# Altium project ENGG4000-SysMoDEL-BMS (1).PrjPcb (part 2 of 2)

## Sheet BMS_MCU.SchDoc
size Tabloid; SheetNumber: 3; SheetTotal: 3
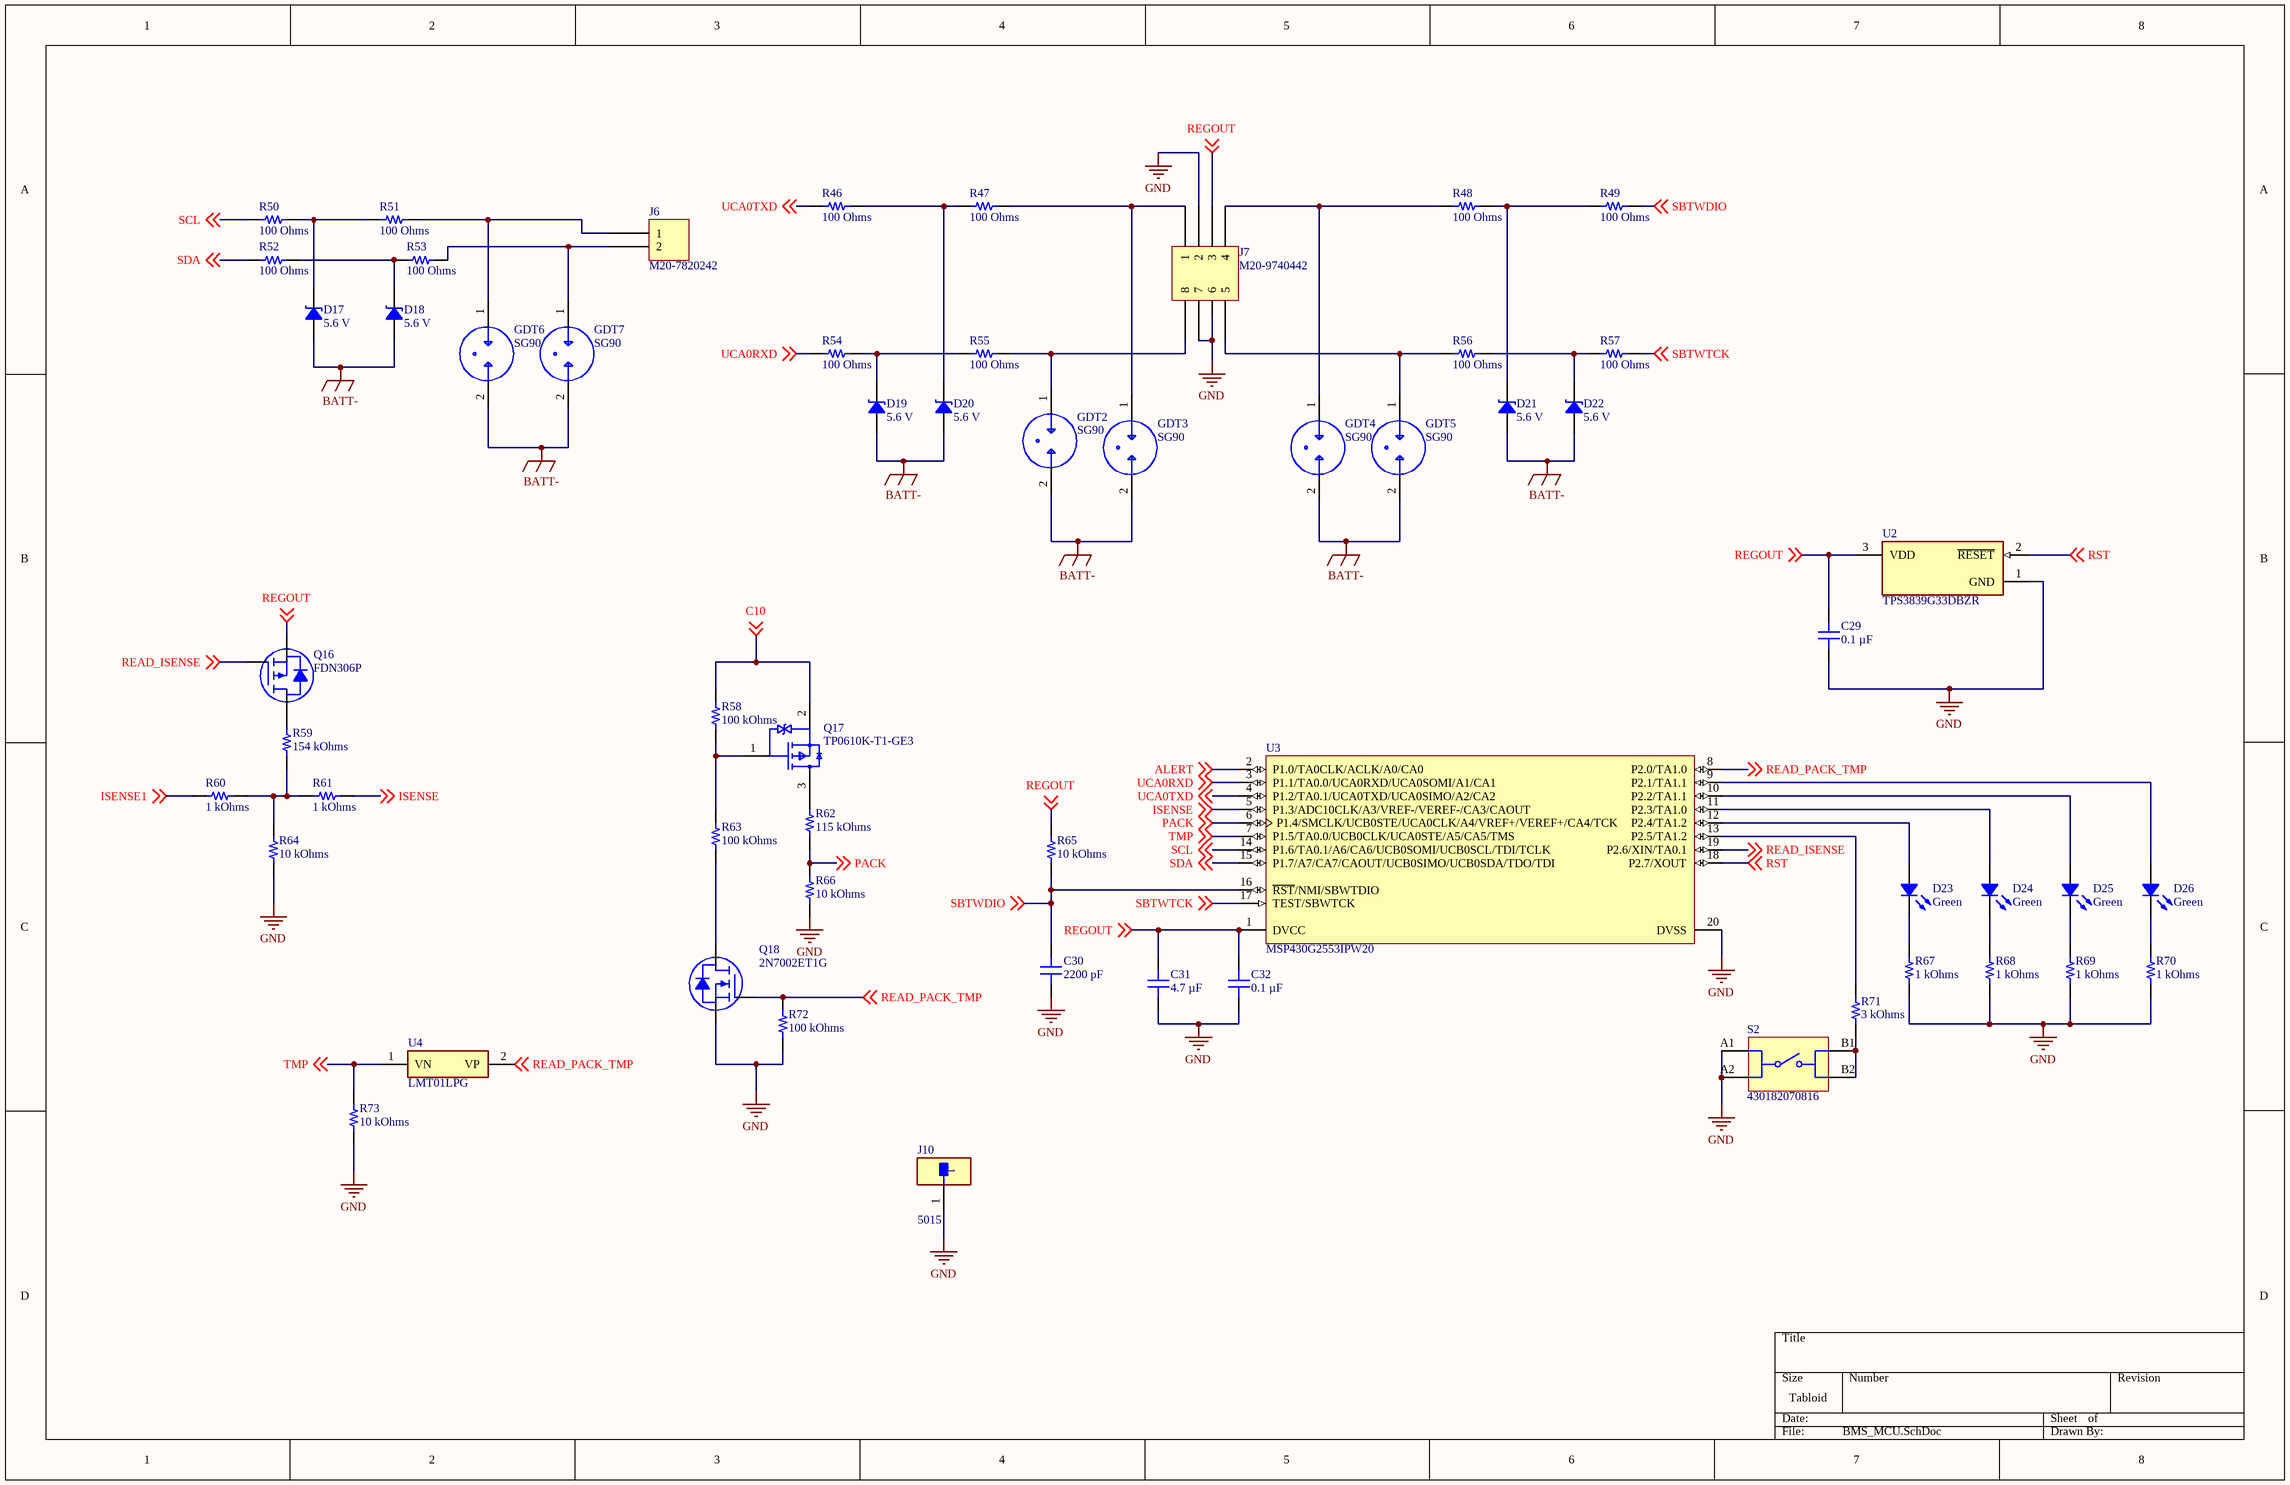
[diagram p2: BMS_MCU.SchDoc]

### Parts
C29  0.1 µF  [CAP 0603_1608]
C30  2200 pF  [CAP 0603_1608]
C31  4.7 µF  [CAP 0805_2012]
C32  0.1 µF  [CAP 0603_1608]
D17  Voltage - Zener (Nom) (Vz): 5.6 V  [SOD323]  (hidden comment: MMSZ5232BS-7-F)
D18  Voltage - Zener (Nom) (Vz): 5.6 V  [SOD323]  (hidden comment: MMSZ5232BS-7-F)
D19  Voltage - Zener (Nom) (Vz): 5.6 V  [SOD323]  (hidden comment: MMSZ5232BS-7-F)
D20  Voltage - Zener (Nom) (Vz): 5.6 V  [SOD323]  (hidden comment: MMSZ5232BS-7-F)
D21  Voltage - Zener (Nom) (Vz): 5.6 V  [SOD323]  (hidden comment: MMSZ5232BS-7-F)
D22  Voltage - Zener (Nom) (Vz): 5.6 V  [SOD323]  (hidden comment: MMSZ5232BS-7-F)
D23  Green  [LED 0603_1608 GREEN]
D24  Green  [LED 0603_1608 GREEN]
D25  Green  [LED 0603_1608 GREEN]
D26  Green  [LED 0603_1608 GREEN]
GDT2  SG90  [FP-SG-MFG]
GDT3  SG90  [FP-SG-MFG]
GDT4  SG90  [FP-SG-MFG]
GDT5  SG90  [FP-SG-MFG]
GDT6  SG90  [FP-SG-MFG]
GDT7  SG90  [FP-SG-MFG]
J6  M20-7820242  [HARWIN M20-7820245]
J7  M20-9740442  [HARWIN M20-9740445]
J10  5015  [FP-5015-MFG]
Q16  FDN306P  [ON SEMI SOT-23-3]
Q17  TP0610K-T1-GE3  [FP-S-03946-IPC_C]
Q18  2N7002ET1G  [ON SEMI SOT-23-3]
R46  100 Ohms  [RES 0805_2012]
R47  100 Ohms  [RES 0805_2012]
R48  100 Ohms  [RES 0805_2012]
R49  100 Ohms  [RES 0805_2012]
R50  100 Ohms  [RES 0805_2012]
R51  100 Ohms  [RES 0805_2012]
R52  100 Ohms  [RES 0805_2012]
R53  100 Ohms  [RES 0805_2012]
R54  100 Ohms  [RES 0805_2012]
R55  100 Ohms  [RES 0805_2012]
R56  100 Ohms  [RES 0805_2012]
R57  100 Ohms  [RES 0805_2012]
R58  100 kOhms  [RES 0603_1608]
R59  154 kOhms  [RES 0603_1608]
R60  1 kOhms  [RES 0603_1608]
R61  1 kOhms  [RES 0603_1608]
R62  115 kOhms  [RES 0603_1608]
R63  100 kOhms  [RES 0603_1608]
R64  10 kOhms  [RES 0603_1608]
R65  10 kOhms  [RES 0603_1608]
R66  10 kOhms  [RES 0603_1608]
R67  1 kOhms  [RES 0603_1608]
R68  1 kOhms  [RES 0603_1608]
R69  1 kOhms  [RES 0603_1608]
R70  1 kOhms  [RES 0603_1608]
R71  3 kOhms  [RES 0603_1608]
R72  100 kOhms  [RES 0603_1608]
R73  10 kOhms  [RES 0603_1608]
S2  430182070816  [430182070816]
U2  TPS3839G33DBZR  [FP-DBZ0003A-MFG]
U3  MSP430G2553IPW20  [PW0020A_L]
U4  LMT01LPG  [FP-LPG0002A-MFG]

### Nets
BATT-: D17.1 D18.1 D19.1 D20.1 D21.1 D22.1 GDT2.2 GDT3.2 GDT4.2 GDT5.2 GDT6.2 GDT7.2
GND: C29.1 C30.1 C31.1 C32.1 J7.2 J7.6 J7.7 J10.1 Q18.2(S) R64.1 R66.1 R67.1 R68.1 R69.1 R70.1 R72.1 R73.1 S2.A1 S2.A2 U2.1(GND) U3.20(DVSS)
ALERT: U3.2(P1.0/TA0CLK/ACLK/A0/CA0) ; off-sheet ALERT
C10: Q17.2(S) R58.2 ; off-sheet C10
ISENSE: R61.2 U3.5(P1.3/ADC10CLK/A3/VREF-/VEREF-/CA3/CAOUT) ; off-sheet ISENSE
ISENSE1: R60.1 ; off-sheet ISENSE1
PACK: R62.1 R66.2 U3.6(P1.4/SMCLK/UCB0STE/UCA0CLK/A4/VREF+/VEREF+/CA4/TCK) ; off-sheet PACK
READ_ISENSE: Q16.1(G) U3.19(P2.6/XIN/TA0.1) ; off-sheet READ_ISENSE
READ_PACK_TMP: Q18.1(G) R72.2 U3.8(P2.0/TA1.0) U4.2(VP) ; off-sheet READ_PACK_TMP
REGOUT: C29.2 C31.2 C32.2 J7.3 Q16.2(S) R65.2 U2.3(VDD) U3.1(DVCC) ; off-sheet REGOUT
RST: U2.2(~{RESET}) U3.18(P2.7/XOUT) ; off-sheet RST
SBTWDIO: C30.2 R49.1 R65.1 U3.16(~{RST}/NMI/SBWTDIO) ; off-sheet SBTWDIO
SBTWTCK: R57.1 U3.17(TEST/SBWTCK) ; off-sheet SBTWTCK
SCL: R50.2 U3.14(P1.6/TA0.1/A6/CA6/UCB0SOMI/UCB0SCL/TDI/TCLK) ; off-sheet SCL
SDA: R52.2 U3.15(P1.7/A7/CA7/CAOUT/UCB0SIMO/UCB0SDA/TDO/TDI) ; off-sheet SDA
TMP: R73.2 U3.7(P1.5/TA0.0/UCB0CLK/UCA0STE/A5/CA5/TMS) U4.1(VN) ; off-sheet TMP
UCA0RXD: R54.2 U3.3(P1.1/TA0.0/UCA0RXD/UCA0SOMI/A1/CA1) ; off-sheet UCA0RXD
UCA0TXD: R46.2 U3.4(P1.2/TA0.1/UCA0TXD/UCA0SIMO/A2/CA2) ; off-sheet UCA0TXD
NetD17_2: D17.2 R50.1 R51.2
NetD18_2: D18.2 R52.1 R53.2
NetD19_2: D19.2 R54.1 R55.2
NetD20_2: D20.2 R46.1 R47.2
NetD21_2: D21.2 R48.1 R49.2
NetD22_2: D22.2 R56.1 R57.2
NetD23_1: D23.1 U3.12(P2.4/TA1.2)
NetD23_2: D23.2 R67.2
NetD24_1: D24.1 U3.11(P2.3/TA1.0)
NetD24_2: D24.2 R68.2
NetD25_1: D25.1 U3.10(P2.2/TA1.1)
NetD25_2: D25.2 R69.2
NetD26_1: D26.1 U3.9(P2.1/TA1.1)
NetD26_2: D26.2 R70.2
NetGDT2_1: GDT2.1 J7.8 R55.1
NetGDT3_1: GDT3.1 J7.1 R47.1
NetGDT4_1: GDT4.1 J7.4 R48.2
NetGDT5_1: GDT5.1 J7.5 R56.2
NetGDT6_1: GDT6.1 J6.1 R51.1
NetGDT7_1: GDT7.1 J6.2 R53.1
NetQ16_3: Q16.3(D) R59.2
NetQ17_1: Q17.1(G) R58.1 R63.2
NetQ17_3: Q17.3(D) R62.2
NetQ18_3: Q18.3(D) R63.1
NetR59_1: R59.1 R60.2 R61.1 R64.2
NetR71_1: R71.1 S2.B1 S2.B2
NetR71_2: R71.2 U3.13(P2.5/TA1.2)

### Library data of the parts
C29 C32 = 885012206046: CAP CER 0.1UF 16V X7R 0603; manufacturer: Würth Elektronik; Tolerance: ±10%; Part Number: 885012206046; Capacitance: 0.1 µF; Applications: General Purpose; componentlink1description: Datasheet; componentlink1url: https://katalog.we-online.de/pbs/datasheet/885012206046.pdf; componentlink2description: DigiKey Link; componentlink2url: https://www.digikey.com/en/products/detail/würth-elektronik/885012206046/5453820; Device Package: 0603 (1608 Metric); lastupdated: 2/9/2024 8:10:12 PM; Lifecycle Status: Active; Minimum Order: 1; Mounting Type: Surface Mount, MLCC; Operating Temperature: -55°C ~ 125°C; Package / Case: 0603 (1608 Metric); packaging: TapeAndReel; partid: 15291; Part Status: Active; price: 0.03; series: WCAP-CSGP; Size / Dimension: 0.063" L x 0.031" W (1.60mm x 0.80mm); Supplier 1: DigiKey; Supplier Part Number 1: 732-7965-1-ND; Temperature Coefficient: X7R; Thickness (Max): 0.034" (0.87mm); value: 0.1 µF; Voltage - Rated: 16V
C30 = 885012206036: CAP CER 2200PF 16V X7R 0603; manufacturer: Würth Elektronik; Tolerance: ±10%; Part Number: 885012206036; Capacitance: 2200 pF; Applications: General Purpose; componentlink1description: Datasheet; componentlink1url: https://katalog.we-online.de/pbs/datasheet/885012206036.pdf; componentlink2description: DigiKey Link; componentlink2url: https://www.digikey.com/en/products/detail/würth-elektronik/885012206036/5453810; Device Package: 0603 (1608 Metric); lastupdated: 2/9/2024 8:10:11 PM; Lifecycle Status: Active; Minimum Order: 1; Mounting Type: Surface Mount, MLCC; Operating Temperature: -55°C ~ 125°C; Package / Case: 0603 (1608 Metric); packaging: TapeAndReel; partid: 15804; Part Status: Active; price: 0.02; series: WCAP-CSGP; Size / Dimension: 0.063" L x 0.031" W (1.60mm x 0.80mm); Supplier 1: DigiKey; Supplier Part Number 1: 732-7955-1-ND; Temperature Coefficient: X7R; Thickness (Max): 0.034" (0.87mm); value: 2200 pF; Voltage - Rated: 16V
C31 = 885012207025: CAP CER 4.7UF 10V X7R 0805; manufacturer: Würth Elektronik; Tolerance: ±10%; Part Number: 885012207025; Capacitance: 4.7 µF; Applications: General Purpose; componentlink1description: Datasheet; componentlink1url: https://katalog.we-online.de/pbs/datasheet/885012207025.pdf; componentlink2description: DigiKey Link; componentlink2url: https://www.digikey.com/en/products/detail/würth-elektronik/885012207025/5453512; Device Package: 0805 (2012 Metric); lastupdated: 2/9/2024 8:15:22 PM; Lifecycle Status: Active; Minimum Order: 1; Mounting Type: Surface Mount, MLCC; Operating Temperature: -55°C ~ 125°C; Package / Case: 0805 (2012 Metric); packaging: TapeAndReel; partid: 17499; Part Status: Active; price: 0.55; series: WCAP-CSGP; Size / Dimension: 0.079" L x 0.049" W (2.00mm x 1.25mm); Supplier 1: DigiKey; Supplier Part Number 1: 732-7657-1-ND; Temperature Coefficient: X7R; Thickness (Max): 0.057" (1.45mm); value: 4.7 µF; Voltage - Rated: 10V
D17-D22 = MMSZ5232BS-7-F: DIODE ZENER 5.6V 200MW SOD323; Manufacturer: Diodes Incorporated; Current - Reverse Leakage @ Vr: 5 µA @ 3 V; Impedance (Max) (Zzt): 11 Ohms; Tolerance: ±5%; Voltage - Forward (Vf) (Max) @ If: 900 mV @ 10 mA; Part Number: MMSZ5232BS-7-F; ComponentLink1Description: Datasheet; ComponentLink1URL: https://www.diodes.com/assets/Datasheets/ds31038.pdf; ComponentLink2Description: DigiKey Link; ComponentLink2URL: https://www.digikey.com/en/products/detail/diodes-incorporated/MMSZ5232BS-7-F/814356; LastUpdated: 6/3/2024 8:20:26 PM; Lifecycle Status: Active; Minimum Order: 1; Mounting Type: Surface Mount; Operating Temperature: -65°C ~ 150°C; Package / Case: SC-76, SOD-323; Packaging: TapeAndReel; PartId: 3555; Part Status: Active; Power - Max: 200 mW; Price: 0.03; Series: -; Supplier 1: DigiKey; Supplier Part Number 1: MMSZ5232BS-FDICT-ND; Supplier Device Package: SOD-323
D23-D26 = 150060GS75000: LED GREEN CLEAR 0603 SMD; Manufacturer: Würth Elektronik; Configuration: Standard; Current - Test: 20mA; Lens Color: Colorless; Lens Size: 1.10mm x 0.70mm; Lens Style: Rectangle with Flat Top; Millicandela Rating: 430mcd; Viewing Angle: 140°; Voltage - Forward (Vf) (Typ): 3.2V; Wavelength - Dominant: 520nm; Wavelength - Peak: 515nm; Part Number: 150060GS75000; Color: Green; ComponentLink1Description: Datasheet; ComponentLink1URL: https://katalog.we-online.de/led/datasheet/150060GS75000.pdf; ComponentLink2Description: DigiKey Link; ComponentLink2URL: https://www.digikey.com/en/products/detail/würth-elektronik/150060GS75000/4489898; Device Package: 0603 (1608 Metric); Height (Max): 0.80mm; LastUpdated: 6/3/2024 7:58:51 PM; Lens Transparency: Clear; Lifecycle Status: Active; Minimum Order: 1; Mounting Type: Surface Mount; Package / Case: 0603 (1608 Metric); Packaging: TapeAndReel; PartId: 686; Part Status: Active; Price: 0.11; Series: WL-SMCW; Size / Dimension: 1.60mm L x 0.80mm W; Supplier 1: DigiKey; Supplier Part Number 1: 732-4971-1-ND; Supplier Device Package: 0603; Value: Green
GDT2-GDT7 = SG90: GDT 90V 2KA 2 POLE SURFACE MOUNT; Fail Short: No; Number of Terminals/Pins: 2; REACH SVHC: No SVHC; Case Code (Imperial): 1812; Case/Package: 1812; Mount: Surface Mount; RoHS Compliant: Yes; Number of Pins: 2; Package Quantity: 2000; Length: 4.5mm; Number of Poles: 2; Min Operating Temperature: -40°C; Case Code (Metric): 4532; Max Operating Temperature: 90°C; Depth: 3.2mm; Termination: SMD/SMT; Packaging: Tape and Reel; Series: SG; Supplier 1: Digikey; Supplier Part Number 1: F4126CT-ND
J6 = M20-7820242: CONN RCPT 2POS 0.1 GOLD PCB; Manufacturer: Harwin Inc.; Connector Type: Receptacle; Contact Length - Post: 0.118" (3.00mm); Current Rating (Amps): 3A; Mated Stacking Heights: 11.04mm, 12.63mm; Material Flammability Rating: UL94 V-0; Number of Positions: 2; Number of Positions Loaded: All; Pitch - Mating: 0.100" (2.54mm); Style: Board to Board or Cable; Part Number: M20-7820242; ComponentLink1Description: Datasheet; ComponentLink1URL: https://cdn.harwin.com/pdfs/C001XX_M20_Series_Connectors.pdf; ComponentLink2Description: DigiKey Link; ComponentLink2URL: https://www.digikey.com/en/products/detail/harwin-inc/M20-7820242/3727744; Contact Finish - Mating: Gold; Contact Finish - Post: Tin; Contact Finish Thickness - Mating: Flash; Contact Type: Female Socket; Fastening Type: Push-Pull; Insulation Color: Black; Insulation Height: 0.335" (8.51mm); LastUpdated: 9/21/2022 6:53:47 PM; Lifecycle Status: Active; Minimum Order: 1; Mounting Type: Through Hole; Number of Rows: 1; Operating Temperature: -40°C ~ 105°C; Packaging: Tube; Part Status: Active; Price: 0.38; Series: M20; Supplier 1: DigiKey; Supplier Part Number 1: 952-1775-ND; Termination: Solder
J7 = M20-9740442: CONN HEADER R/A 8POS 2.54MM; Manufacturer: Harwin Inc.; Connector Type: Header, Cuttable; Current Rating (Amps): 3A per Contact; Material Flammability Rating: UL94 V-0; Number of Positions: 8; Number of Positions Loaded: All; Shrouding: Unshrouded; Style: Board to Board or Cable; Part Number: M20-9740442; ComponentLink1Description: Datasheet; ComponentLink1URL: https://cdn.harwin.com/pdfs/M20-974.pdf; ComponentLink2Description: DigiKey Link; ComponentLink2URL: http://digikey.com/product-detail/en/harwin-inc/M20-9740442/M20-9740442-ND/3920714; Contact Finish - Mating: Gold; Contact Finish - Post: Tin; Contact Material: Brass; Contact Shape: Square; Contact Type: Male Pin; Fastening Type: Push-Pull; Insulation Color: Black; Insulation Material: Polyamide (PA6T), Nylon 6T; LastUpdated: 9/21/2022 7:17:53 PM; Lifecycle Status: Active; Minimum Order: 5000; Mounting Type: Through Hole, Right Angle; Number of Rows: 2; Operating Temperature: -40°C ~ 105°C; Packaging: Bulk; PartId: 157; Part Status: Active; Price: 0.18; Series: M20; Supplier 1: DigiKey; Supplier Part Number 1: M20-9740442-ND; Termination: Solder
J10 = Test Point: PC TEST POINT MINIATURE; Manufacturer: keystone; Number Of Contacts: 1; Conn Orientation: Straight; Category: Conn; Manufacturer Part Number: 5015; Digikey Description: PC TEST POINT MINIATURE; Automotive: No; Lead Free: Yes; Octopart: https://octopart.com/5015-keystone-3822; ComponentLink2URL: http://www.keyelco.com/product-pdf.cfm?p=1353; Package: 5015; RoHS: TRUE; Device Class L3: unset; Device Class L2: unset; Contact Material: Silver; Device Class L1: Connectors; Height: 1.65mm; ComponentLink2Description: Datasheet
Q16 = FDN306P: MOSFET P-CH 12V 2.6A SSOT3; Manufacturer: ON Semiconductor; Current - Continuous Drain (Id) @ 25°C: 2.6A (Ta); Drive Voltage (Max Rds On,  Min Rds On): 1.8V, 4.5V; FET Type: P-Channel; Gate Charge (Qg) (Max) @ Vgs: 17nC @ 4.5V; Input Capacitance (Ciss) (Max) @ Vds: 1138pF @ 6V; Power Dissipation (Max): 500mW (Ta); Rds On (Max) @ Id, Vgs: 40mOhm @ 2.6A, 4.5V; Vgs (Max): ±8V; Vgs(th) (Max) @ Id: 1.5V @ 250µA; Part Number: FDN306P; ComponentLink1Description: Datasheet; ComponentLink1URL: https://www.onsemi.com/pub/Collateral/FDN306P-D.pdf; ComponentLink2Description: DigiKey Link; ComponentLink2URL: http://digikey.com/product-detail/en/on-semiconductor/FDN306P/FDN306PCT-ND/965600; Drain to Source Voltage (Vdss): 12V; LastUpdated: 6/3/2024 8:15:27 PM; Lifecycle Status: Active; Minimum Order: 1; Mounting Type: Surface Mount; Operating Temperature: -55°C ~ 150°C (TJ); Package / Case: TO-236-3, SC-59, SOT-23-3; Packaging: TapeAndReel; Part Status: Active; Price: 0.13; Series: PowerTrench®; Supplier 1: DigiKey; Supplier Part Number 1: FDN306PCT-ND; Supplier Device Package: SuperSOT-3; Technology: MOSFET (Metal Oxide)
Q17 = TP0610K-T1-GE3: MOSFET P-CH 60V 185MA SOT23-3; Nominal Vgs: -1V; Polarity: P-CHANNEL; Power Dissipation: 350mW; Element Configuration: Single; Threshold Voltage: -2V; Turn-Off Delay Time: 35ns; Turn-On Delay Time: 20ns; Gate to Source Voltage (Vgs): 20V; Number of Elements: 1; Drain to Source Voltage (Vdss): -60V; Input Capacitance: 155pF; Rds On Max: 190mR; Continuous Drain Current (ID): -185mA; Drain to Source Resistance: 10R; Max Operating Temperature: 150°C; Height: 1.02mm; Weight: 0.050717oz; Radiation Hardening: No; Package Quantity: 1; Min Operating Temperature: -55°C; Packaging: Tape and Reel; Case/Package: SOT-23-3; Width: 1.4mm; Mount: Surface Mount; Series: TrenchFET®; Length: 3.04mm; Max Power Dissipation: 350mW; RoHS Compliant: Yes; Drain to Source Breakdown Voltage: -60V; Number of Pins: 3; Lead Free: Lead Free; Number of Channels: 1; Supplier 1: Mouser; Supplier Part Number 1: 781-TP0610K-T1-GE3
Q18 = 2N7002ET1G: MOSFET N-CH 60V 260MA SOT-23; Manufacturer: ON Semiconductor; Current - Continuous Drain (Id) @ 25°C: 260mA (Ta); Drive Voltage (Max Rds On,  Min Rds On): 4.5V, 10V; FET Type: N-Channel; Gate Charge (Qg) (Max) @ Vgs: 0.81nC @ 5V; Input Capacitance (Ciss) (Max) @ Vds: 26.7pF @ 25V; Power Dissipation (Max): 300mW (Tj); Rds On (Max) @ Id, Vgs: 2.5Ohm @ 240mA, 10V; Vgs (Max): ±20V; Vgs(th) (Max) @ Id: 2.5V @ 250µA; Part Number: 2N7002ET1G; ComponentLink1Description: Datasheet; ComponentLink1URL: http://www.onsemi.com/pub/Collateral/2N7002E-D.PDF; ComponentLink2Description: DigiKey Link; ComponentLink2URL: http://digikey.com/product-detail/en/on-semiconductor/2N7002ET1G/2N7002ET1GOSCT-ND/1967029; Drain to Source Voltage (Vdss): 60V; LastUpdated: 6/3/2024 8:15:26 PM; Lifecycle Status: Active; Minimum Order: 1; Mounting Type: Surface Mount; Operating Temperature: -55°C ~ 150°C (TJ); Package / Case: TO-236-3, SC-59, SOT-23-3; Packaging: TapeAndReel; Part Status: Active; Price: 0.03; Series: -; Supplier 1: DigiKey; Supplier Part Number 1: 2N7002ET1GOSCT-ND; Supplier Device Package: SOT-23-3 (TO-236); Technology: MOSFET (Metal Oxide)
R46-R57 = CRCW0805100RFKEA: RES SMD 100 OHM 1% 1/8W 0805; Manufacturer: Vishay Dale; Power (Watts): 0.125W, 1/8W; Temperature Coefficient: ±100ppm/°C; Part Number: CRCW0805100RFKEA; Value: 100 Ohms; ComponentLink1Description: Datasheet; ComponentLink1URL: http://www.vishay.com/docs/20035/dcrcwe3.pdf; ComponentLink2Description: DigiKey Link; ComponentLink2URL: https://www.digikey.com/en/products/detail/vishay-dale/CRCW0805100RFKEA/1175523; Composition: Thick Film; Device Package: 0805 (2012 Metric); Features: Automotive AEC-Q200; Height - Seated (Max): 0.020" (0.50mm); LastUpdated: 2/8/2024 9:02:37 PM; Lifecycle Status: Active; Minimum Order: 1; Number of Terminations: 2; Operating Temperature: -55°C ~ 155°C; Package / Case: 0805 (2012 Metric); Packaging: TapeAndReel; PartId: 28106; Part Status: Active; Price: 0.01; Ratings: AEC-Q200; Resistance: 100 Ohms; Series: CRCW; Size / Dimension: 0.079" L x 0.049" W (2.00mm x 1.25mm); Supplier 1: DigiKey; Supplier Part Number 1: 541-100CCT-ND; Supplier Device Package: 0805; Tolerance: ±1%
R58 R63 R72 = CRCW0603100KJNEA: RES SMD 100K OHM 5% 1/10W 0603; Manufacturer: Vishay Dale; Power (Watts): 0.1W, 1/10W; Temperature Coefficient: ±200ppm/°C; Part Number: CRCW0603100KJNEA; Value: 100 kOhms; ComponentLink1Description: Datasheet; ComponentLink1URL: http://www.vishay.com/docs/20035/dcrcwe3.pdf; ComponentLink2Description: DigiKey Link; ComponentLink2URL: https://www.digikey.com/en/products/detail/vishay-dale/CRCW0603100KJNEA/1174277; Composition: Thick Film; Device Package: 0603 (1608 Metric); Features: Automotive AEC-Q200; Height - Seated (Max): 0.020" (0.50mm); LastUpdated: 2/9/2024 8:42:33 PM; Lifecycle Status: Active; Minimum Order: 1; Number of Terminations: 2; Operating Temperature: -55°C ~ 155°C; Package / Case: 0603 (1608 Metric); Packaging: TapeAndReel; PartId: 21189; Part Status: Active; Price: 0.01; Ratings: AEC-Q200; Resistance: 100 kOhms; Series: CRCW; Size / Dimension: 0.063" L x 0.033" W (1.60mm x 0.85mm); Supplier 1: DigiKey; Supplier Part Number 1: 541-100KGCT-ND; Supplier Device Package: 0603; Tolerance: ±5%
R59 = CRCW0603154KFKEA: RES SMD 154K OHM 1% 1/10W 0603; Manufacturer: Vishay Dale; Power (Watts): 0.1W, 1/10W; Temperature Coefficient: ±100ppm/°C; Part Number: CRCW0603154KFKEA; Value: 154 kOhms; ComponentLink1Description: Datasheet; ComponentLink1URL: http://www.vishay.com/docs/20035/dcrcwe3.pdf; ComponentLink2Description: DigiKey Link; ComponentLink2URL: https://www.digikey.com/en/products/detail/vishay-dale/CRCW0603154KFKEA/1174915; Composition: Thick Film; Device Package: 0603 (1608 Metric); Features: Automotive AEC-Q200; Height - Seated (Max): 0.020" (0.50mm); LastUpdated: 2/9/2024 8:42:56 PM; Lifecycle Status: Active; Minimum Order: 1; Number of Terminations: 2; Operating Temperature: -55°C ~ 155°C; Package / Case: 0603 (1608 Metric); Packaging: TapeAndReel; PartId: 15296; Part Status: Active; Price: 0.01; Ratings: AEC-Q200; Resistance: 154 kOhms; Series: CRCW; Size / Dimension: 0.061" L x 0.033" W (1.55mm x 0.85mm); Supplier 1: DigiKey; Supplier Part Number 1: 541-154KHCT-ND; Supplier Device Package: 0603; Tolerance: ±1%
R60 R61 R67-R70 = CRCW06031K00JNEA: RES SMD 1K OHM 5% 1/10W 0603; Manufacturer: Vishay Dale; Power (Watts): 0.1W, 1/10W; Temperature Coefficient: ±200ppm/°C; Part Number: CRCW06031K00JNEA; Value: 1 kOhms; ComponentLink1Description: Datasheet; ComponentLink1URL: http://www.vishay.com/docs/20035/dcrcwe3.pdf; ComponentLink2Description: DigiKey Link; ComponentLink2URL: https://www.digikey.com/en/products/detail/vishay-dale/CRCW06031K00JNEA/1174229; Composition: Thick Film; Device Package: 0603 (1608 Metric); Features: Automotive AEC-Q200; Height - Seated (Max): 0.020" (0.50mm); LastUpdated: 2/9/2024 8:42:33 PM; Lifecycle Status: Active; Minimum Order: 1; Number of Terminations: 2; Operating Temperature: -55°C ~ 155°C; Package / Case: 0603 (1608 Metric); Packaging: TapeAndReel; PartId: 21209; Part Status: Active; Price: 0.01; Ratings: AEC-Q200; Resistance: 1 kOhms; Series: CRCW; Size / Dimension: 0.063" L x 0.033" W (1.60mm x 0.85mm); Supplier 1: DigiKey; Supplier Part Number 1: 541-1.0KGCT-ND; Supplier Device Package: 0603; Tolerance: ±5%
R62 = CRCW0603115KFKEA: RES SMD 115K OHM 1% 1/10W 0603; Manufacturer: Vishay Dale; Power (Watts): 0.1W, 1/10W; Temperature Coefficient: ±100ppm/°C; Part Number: CRCW0603115KFKEA; Value: 115 kOhms; ComponentLink1Description: Datasheet; ComponentLink1URL: http://www.vishay.com/docs/20035/dcrcwe3.pdf; ComponentLink2Description: DigiKey Link; ComponentLink2URL: https://www.digikey.com/en/products/detail/vishay-dale/CRCW0603115KFKEA/1174902; Composition: Thick Film; Device Package: 0603 (1608 Metric); Features: Automotive AEC-Q200; Height - Seated (Max): 0.020" (0.50mm); LastUpdated: 2/9/2024 8:42:11 PM; Lifecycle Status: Active; Minimum Order: 1; Number of Terminations: 2; Operating Temperature: -55°C ~ 155°C; Package / Case: 0603 (1608 Metric); Packaging: TapeAndReel; PartId: 24531; Part Status: Active; Price: 0.01; Ratings: AEC-Q200; Resistance: 115 kOhms; Series: CRCW; Size / Dimension: 0.061" L x 0.033" W (1.55mm x 0.85mm); Supplier 1: DigiKey; Supplier Part Number 1: 541-115KHCT-ND; Supplier Device Package: 0603; Tolerance: ±1%
R64-R66 R73 = CRCW060310K0FKEA: RES SMD 10K OHM 1% 1/10W 0603; Manufacturer: Vishay Dale; Power (Watts): 0.1W, 1/10W; Temperature Coefficient: ±100ppm/°C; Part Number: CRCW060310K0FKEA; Value: 10 kOhms; ComponentLink1Description: Datasheet; ComponentLink1URL: http://www.vishay.com/docs/20035/dcrcwe3.pdf; ComponentLink2Description: DigiKey Link; ComponentLink2URL: https://www.digikey.com/en/products/detail/vishay-dale/CRCW060310K0FKEA/1174782; Composition: Thick Film; Device Package: 0603 (1608 Metric); Features: Automotive AEC-Q200; Height - Seated (Max): 0.020" (0.50mm); LastUpdated: 2/9/2024 8:42:10 PM; Lifecycle Status: Active; Minimum Order: 1; Number of Terminations: 2; Operating Temperature: -55°C ~ 155°C; Package / Case: 0603 (1608 Metric); Packaging: CutTape; PartId: 24636; Part Status: Active; Price: 0.01; Ratings: AEC-Q200; Resistance: 10 kOhms; Series: CRCW; Size / Dimension: 0.061" L x 0.033" W (1.55mm x 0.85mm); Supplier 1: DigiKey; Supplier Part Number 1: 541-10.0KHCT-ND; Supplier Device Package: 0603; Tolerance: ±1%
R71 = CRCW06033K00JNEA: RES SMD 3K OHM 5% 1/10W 0603; Manufacturer: Vishay Dale; Power (Watts): 0.1W, 1/10W; Temperature Coefficient: ±200ppm/°C; Part Number: CRCW06033K00JNEA; Value: 3 kOhms; ComponentLink1Description: Datasheet; ComponentLink1URL: http://www.vishay.com/docs/20035/dcrcwe3.pdf; ComponentLink2Description: DigiKey Link; ComponentLink2URL: https://www.digikey.com/en/products/detail/vishay-dale/CRCW06033K00JNEA/1174240; Composition: Thick Film; Device Package: 0603 (1608 Metric); Features: Automotive AEC-Q200; Height - Seated (Max): 0.020" (0.50mm); LastUpdated: 2/9/2024 8:42:33 PM; Lifecycle Status: Active; Minimum Order: 1; Number of Terminations: 2; Operating Temperature: -55°C ~ 155°C; Package / Case: 0603 (1608 Metric); Packaging: TapeAndReel; PartId: 21261; Part Status: Active; Price: 0.01; Ratings: AEC-Q200; Resistance: 3 kOhms; Series: CRCW; Size / Dimension: 0.063" L x 0.033" W (1.60mm x 0.85mm); Supplier 1: DigiKey; Supplier Part Number 1: 541-3.0KGCT-ND; Supplier Device Package: 0603; Tolerance: ±5%
S2 = 430182070816: Switch Tactile Spst-no 0.05A 12V; Life (Cycles): 1Mcycles; Switch Travel: 250µm; Throw Configuration: SPST; Switch Function: Off-Mom; Actuator Material: Liquid Crystal Polymer, Polymer; Contact Current Rating: 50mA; Illumination Type: Illuminated, Non-Illuminated; Insulation Resistance: 100MΩ; Actuator Length: 3.6mm; Color: Black; Mount: Surface Mount; Contact Material: Stainless Steel, Steel; REACH SVHC: No SVHC; Width: 6.2mm; Voltage Rating (DC): 12V; RoHS: Compliant; Length: 6.2mm; Height: 7mm; Current Rating: 50mA; Lead Free: Lead Free; Termination: Gull Wing; Min Operating Temperature: -40°C; Voltage Rating: 12V; Max Operating Temperature: 85°C; Diameter: 3mm; Contact Plating: Silver; Packaging: Tape and Reel; Mechanical Life: 1Mcycles; Contact Resistance: 100mΩ; Supplier 1: Mouser; Supplier Part Number 1: 710-430182070816
U2 = TPS3839G33DBZR: IC SUPERVISOR 1 CHANNEL SOT23-3; Output: TOTEM-POLE; Reset Timeout: 120ms; Quiescent Current: 150nA; Watchdog Timer: No; Reset: Active Low; Min Supply Voltage: 600mV; Threshold Voltage: 3.08V; Max Reset Threshold Voltage: 3.126V; Max Supply Voltage: 6.5V; Max Supply Current: 500nA; Min Reset Threshold Voltage: 3.003V; Number of Voltages Monitored: 1; RoHS Compliant: Yes; Number of Pins: 3; Max Operating Temperature: 85°C; Case/Package: SOT-23; Radiation Hardening: No; Packaging: Tape and Reel; Min Operating Temperature: -40°C; Type: Simple Reset/Power-On Reset; Package Quantity: 3000; Series: TPS3839G33; Mount: Surface Mount; Lead Free: Lead Free; Supplier 1: Mouser; Supplier Part Number 1: 595-TPS3839G33DBZR
U3 = MSP430G2553IPW20: 16 MHz Mixed Signal Microcontroller with 16 KB Flash, 512 B SRAM and 24 GPIOs, -40 to 85 degC, 20-pin SOP (PW), Green (RoHS & no Sb/Br); Manufacturer: Texas Instruments; Timers - 16-bit: 2; Temp Sensor: Yes; USCI_B (I2C & SPI): 1; SRAM(B): 512; ADC: 10-bit SAR; Frequency(MHz): 16; SubFamily: Value Line; ADC Channels: 8; GPIO: 24; PackageVersion: 4040064-5/G; PartNumber: MSP430G2553IPW20; DatasheetVersion: SLAS735G; ComponentLink2URL: http://www.ti.com/general/docs/lit/getliterature.tsp?genericPartNumber=MSP430G2553&fileType=pdf; Code_JEDEC: MO-153; PackageDescription: 20-Pin Plastic Small Outline, Body 6.5 x 4.4 mm, 0.65 mm Pitch; Eco-Plan: Green (RoHS & no Sb/Br); ComponentLink3Description: Package Specification; Watchdog: Yes; Flash(KB): 16; ComponentLink2Description: Datasheet; Brown Out Reset: Yes; Comparators: Yes; ComponentLink1URL: http://www.ti.com/; ComponentLink1Description: Manufacturer URL; Cap touch I/O: Yes; USCI_A (UART/LIN/IrDA/SPI): 1; PackageReference: PW0020A; Mounting Technology: Surface Mount; ComponentLink3URL: http://www.ti.com.cn/cn/lit/ml/mpds362/mpds362.pdf; Supplier 1: Mouser; Supplier Part Number 1: 595-MSP430G2553IPW20
U4 = LMT01LPG: SENSOR DIGITAL -50C-150C TO92-2; Manufacturer: Texas Instruments; Max Supply Voltage: 5.5V; Resolution: 13bits; Operating Supply Current: 39uA; Min Supply Voltage: 2V; Sensor Output: Analog Voltage,Other; Ambient Temperature Range Low: -50°C; Category: IC; Temperature: -50°C to +150°C; Octopart: https://octopart.com/lmt01lpg-texas+instruments-60770464; Digikey Description: SENSOR DIGITAL -50C-150C TO92-2; Temperature Range High: +150°C; Device Class L2: Temperature and Humidity Sensors; Mouser Description: 0.5°C Accurate 2-pin Temperature Sensor with a Pulse Train Interface 2-TO-92 -50 to 150; Package: LPG0002A; Ambient Temperature Range High: +150°C; Manufacturer Part Number: LMT01LPG; Lead Free: Yes; Height: 5.05mm; ComponentLink2URL: https://www.ti.com/lit/ds/symlink/lmt01.pdf; Temperature Range Low: -50°C; ComponentLink2Description: Datasheet; Automotive: No; Device Class L3: unset; RoHS: TRUE; Device Class L1: Sensors; Supplier 1: Mouser; Supplier Part Number 1: 595-LMT01LPG

## Nets that join several sheets
BATT-: BMS_FETs (7 pins), BMS_MCU (12 pins)
GND: BMS_AFE (11 pins), BMS_FETs (C25.1 C26.2 NT1.1 Q11.1), BMS_MCU (21 pins)
ALERT: BMS_AFE (C17.2 R30.2 U1.30), BMS_MCU (U3.2)
C10: BMS_AFE (6 pins), BMS_MCU (Q17.2 R58.2)
CHG: BMS_AFE (U1.2), BMS_FETs (Q11.2)
DSG: BMS_AFE (U1.1), BMS_FETs (FB1.2 FB2.2 R41.2)
ISENSE1: BMS_FETs (8 pins), BMS_MCU (R60.1)
REGOUT: BMS_AFE (C12.2 R22.2 R23.2 U1.8), BMS_MCU (8 pins)
SCL: BMS_AFE (R23.1 U1.5), BMS_MCU (R50.2 U3.14)
SDA: BMS_AFE (R22.1 U1.4), BMS_MCU (R52.2 U3.15)
SRN: BMS_AFE (U1.29), BMS_FETs (C23.2 C26.1 R40.2)
SRP: BMS_AFE (U1.28), BMS_FETs (C23.1 C25.2 R39.2)